# Altium schematic sheet input_protection.SchDoc
size A; SheetNumber: 2; SheetTotal: 2
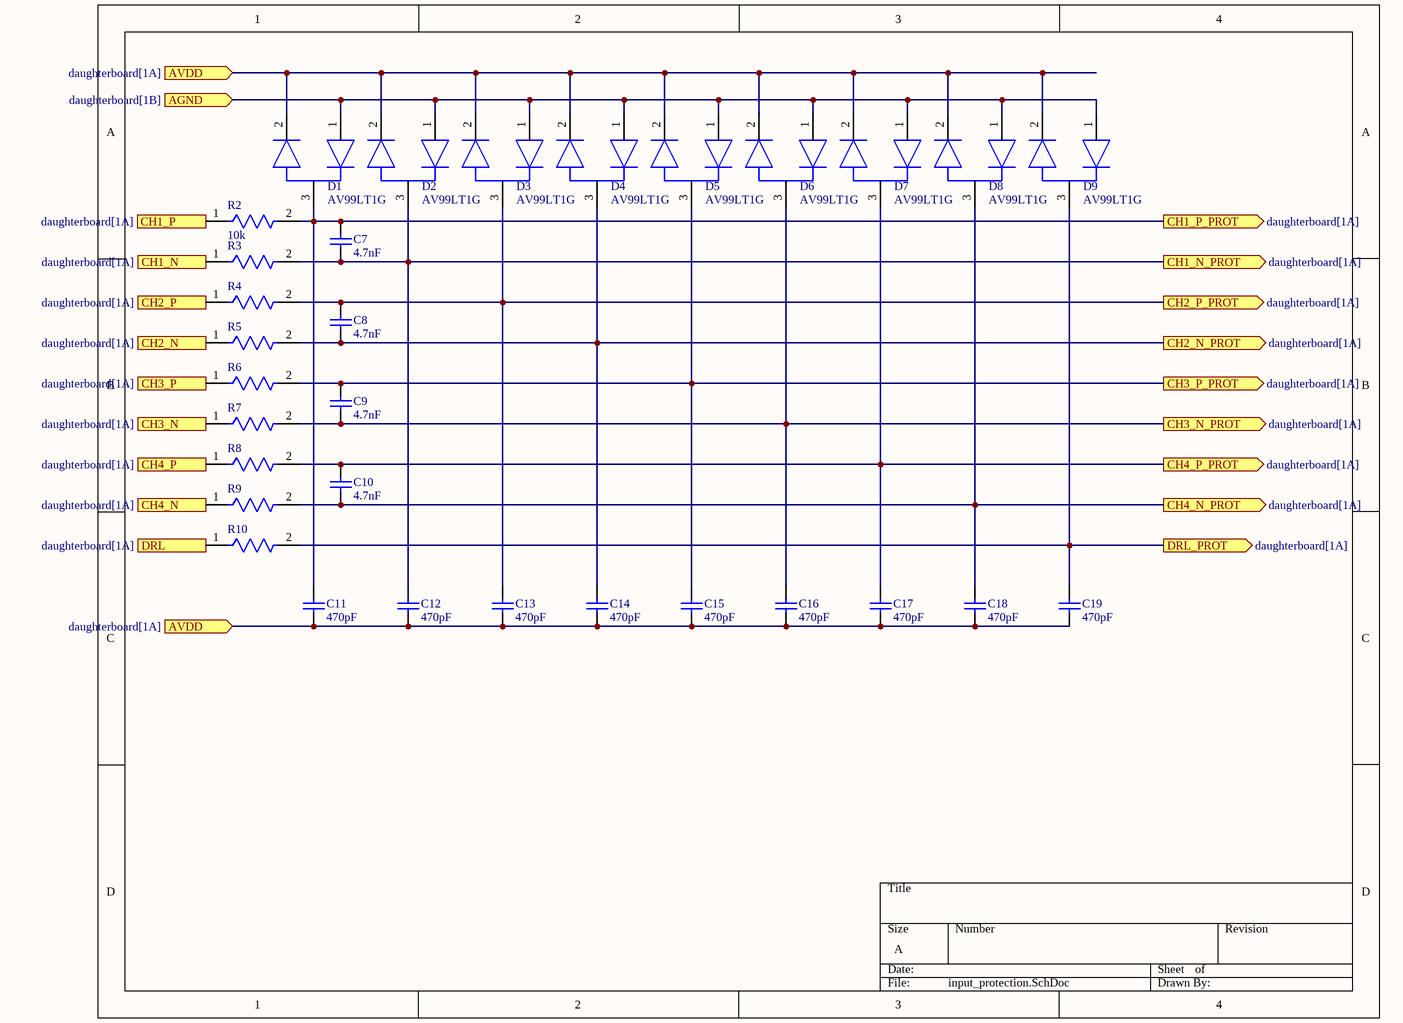
[diagram p0: input_protection.SchDoc]

## Parts
C7  4.7nF  [CAPC2013X145X48ML20T23]
C8  4.7nF  [CAPC2013X145X48ML20T23]
C9  4.7nF  [CAPC2013X145X48ML20T23]
C10  4.7nF  [CAPC2013X145X48ML20T23]
C11  470pF  [CAPC2013X145X48NL20T23]
C12  470pF  [CAPC2013X145X48NL20T23]
C13  470pF  [CAPC2013X145X48NL20T23]
C14  470pF  [CAPC2013X145X48NL20T23]
C15  470pF  [CAPC2013X145X48NL20T23]
C16  470pF  [CAPC2013X145X48NL20T23]
C17  470pF  [CAPC2013X145X48NL20T23]
C18  470pF  [CAPC2013X145X48NL20T23]
C19  470pF  [CAPC2013X145X48NL20T23]
D1  AV99LT1G  [FP-318-08-IPC_B]
D2  AV99LT1G  [FP-318-08-IPC_B]
D3  AV99LT1G  [FP-318-08-IPC_B]
D4  AV99LT1G  [FP-318-08-IPC_B]
D5  AV99LT1G  [FP-318-08-IPC_B]
D6  AV99LT1G  [FP-318-08-IPC_B]
D7  AV99LT1G  [FP-318-08-IPC_B]
D8  AV99LT1G  [FP-318-08-IPC_B]
D9  AV99LT1G  [FP-318-08-IPC_B]
R2  10k  [FP-RN73R2B-MFG]
R3  10k - RN73R2BTTD1001F25  [FP-RN73R2B-MFG]  (value not drawn)
R4  10k - RN73R2BTTD1001F25  [FP-RN73R2B-MFG]  (value not drawn)
R5  10k - RN73R2BTTD1001F25  [FP-RN73R2B-MFG]  (value not drawn)
R6  10k - RN73R2BTTD1001F25  [FP-RN73R2B-MFG]  (value not drawn)
R7  10k - RN73R2BTTD1001F25  [FP-RN73R2B-MFG]  (value not drawn)
R8  10k - RN73R2BTTD1001F25  [FP-RN73R2B-MFG]  (value not drawn)
R9  10k - RN73R2BTTD1001F25  [FP-RN73R2B-MFG]  (value not drawn)
R10  10k - RN73R2BTTD1001F25  [FP-RN73R2B-MFG]  (value not drawn)

## Ports
AGND (in, see daughterboard[1B]), AVDD (in, see daughterboard[1A]), CH1_N (in, see daughterboard[1A]), CH1_N_PROT (out, see daughterboard[1A]), CH1_P (in, see daughterboard[1A]), CH1_P_PROT (out, see daughterboard[1A]), CH2_N (in, see daughterboard[1A]), CH2_N_PROT (out, see daughterboard[1A]), CH2_P (in, see daughterboard[1A]), CH2_P_PROT (out, see daughterboard[1A]), CH3_N (in, see daughterboard[1A]), CH3_N_PROT (out, see daughterboard[1A]), CH3_P (in, see daughterboard[1A]), CH3_P_PROT (out, see daughterboard[1A]), CH4_N (in, see daughterboard[1A]), CH4_N_PROT (out, see daughterboard[1A]), CH4_P (in, see daughterboard[1A]), CH4_P_PROT (out, see daughterboard[1A]), DRL (in, see daughterboard[1A]), DRL_PROT (out, see daughterboard[1A])

## Nets
AGND: D1.1(A) D2.1(A) D3.1(A) D4.1(A) D5.1(A) D6.1(A) D7.1(A) D8.1(A) D9.1(A) ; port AGND
AVDD: C11.1 C12.1 C13.1 C14.1 C15.1 C16.1 C17.1 C18.1 C19.1 D1.2(C) D2.2(C) D3.2(C) D4.2(C) D5.2(C) D6.2(C) D7.2(C) D8.2(C) D9.2(C) ; port AVDD
CH1_N: R3.1 ; port CH1_N
CH1_N_PROT: C7.1 C12.2 D2.3(CATHODE/ANODE) R3.2 ; port CH1_N_PROT
CH1_P: R2.1 ; port CH1_P
CH1_P_PROT: C7.2 C11.2 D1.3(CATHODE/ANODE) R2.2 ; port CH1_P_PROT
CH2_N: R5.1 ; port CH2_N
CH2_N_PROT: C8.1 C14.2 D4.3(CATHODE/ANODE) R5.2 ; port CH2_N_PROT
CH2_P: R4.1 ; port CH2_P
CH2_P_PROT: C8.2 C13.2 D3.3(CATHODE/ANODE) R4.2 ; port CH2_P_PROT
CH3_N: R7.1 ; port CH3_N
CH3_N_PROT: C9.1 C16.2 D6.3(CATHODE/ANODE) R7.2 ; port CH3_N_PROT
CH3_P: R6.1 ; port CH3_P
CH3_P_PROT: C9.2 C15.2 D5.3(CATHODE/ANODE) R6.2 ; port CH3_P_PROT
CH4_N: R9.1 ; port CH4_N
CH4_N_PROT: C10.1 C18.2 D8.3(CATHODE/ANODE) R9.2 ; port CH4_N_PROT
CH4_P: R8.1 ; port CH4_P
CH4_P_PROT: C10.2 C17.2 D7.3(CATHODE/ANODE) R8.2 ; port CH4_P_PROT
DRL: R10.1 ; port DRL
DRL_PROT: C19.2 D9.3(CATHODE/ANODE) R10.2 ; port DRL_PROT

## Library data of the parts
C7-C10 = CMP-2007-01915-1: Part Number: VJ0805Y472KXBMC; Manufacturer: Vitramon
C11-C19 = CMP-2007-03106-1: Part Number: VJ0805A471JXBMC; Manufacturer: Vitramon
D1-D9 = CMP-07163-000036-1: DIODE ARRAY 100V 215MA SOT23-3; Capacitance: 1.5pF; Current Rating: 200mA; Max Repetitive Reverse Voltage (Vrrm): 70V; Forward Voltage: 1.25V; Max Forward Surge Current (Ifsm): 500mA; Peak Reverse Current: 2.5uA; Forward Current: 150mA; Peak Non-Repetitive Surge Current: 2A; Reverse Recovery Time: 6ns; Length: 2.9mm; Voltage Rating (DC): 70V; Case/Package: SOT-23; Height: 0.94mm; Number of Pins: 3; Mount: Surface Mount; Min Operating Temperature: -65°C; Lead Free: Lead Free; REACH SVHC: No SVHC; Width: 1.3mm; Packaging: Tape and Reel; Max Operating Temperature: 150°C
R2-R10 = CMP-04015-029161-1: 1kΩ ±1% 0.25W, 1/4W Chip Resistor 1206 (3216 Metric) Moisture Resistant Thin Film